# Altium schematic sheet IR_Sensor.SchDoc: IR_Sensor
size D; SheetNumber: 3; SheetTotal: 3; Project: IR_Sensor; ENG_APP_DATE: --/--/--; DSN_APP_DATE: --/--/--; CHK_APP_DATE: --/--/--; Version: 1
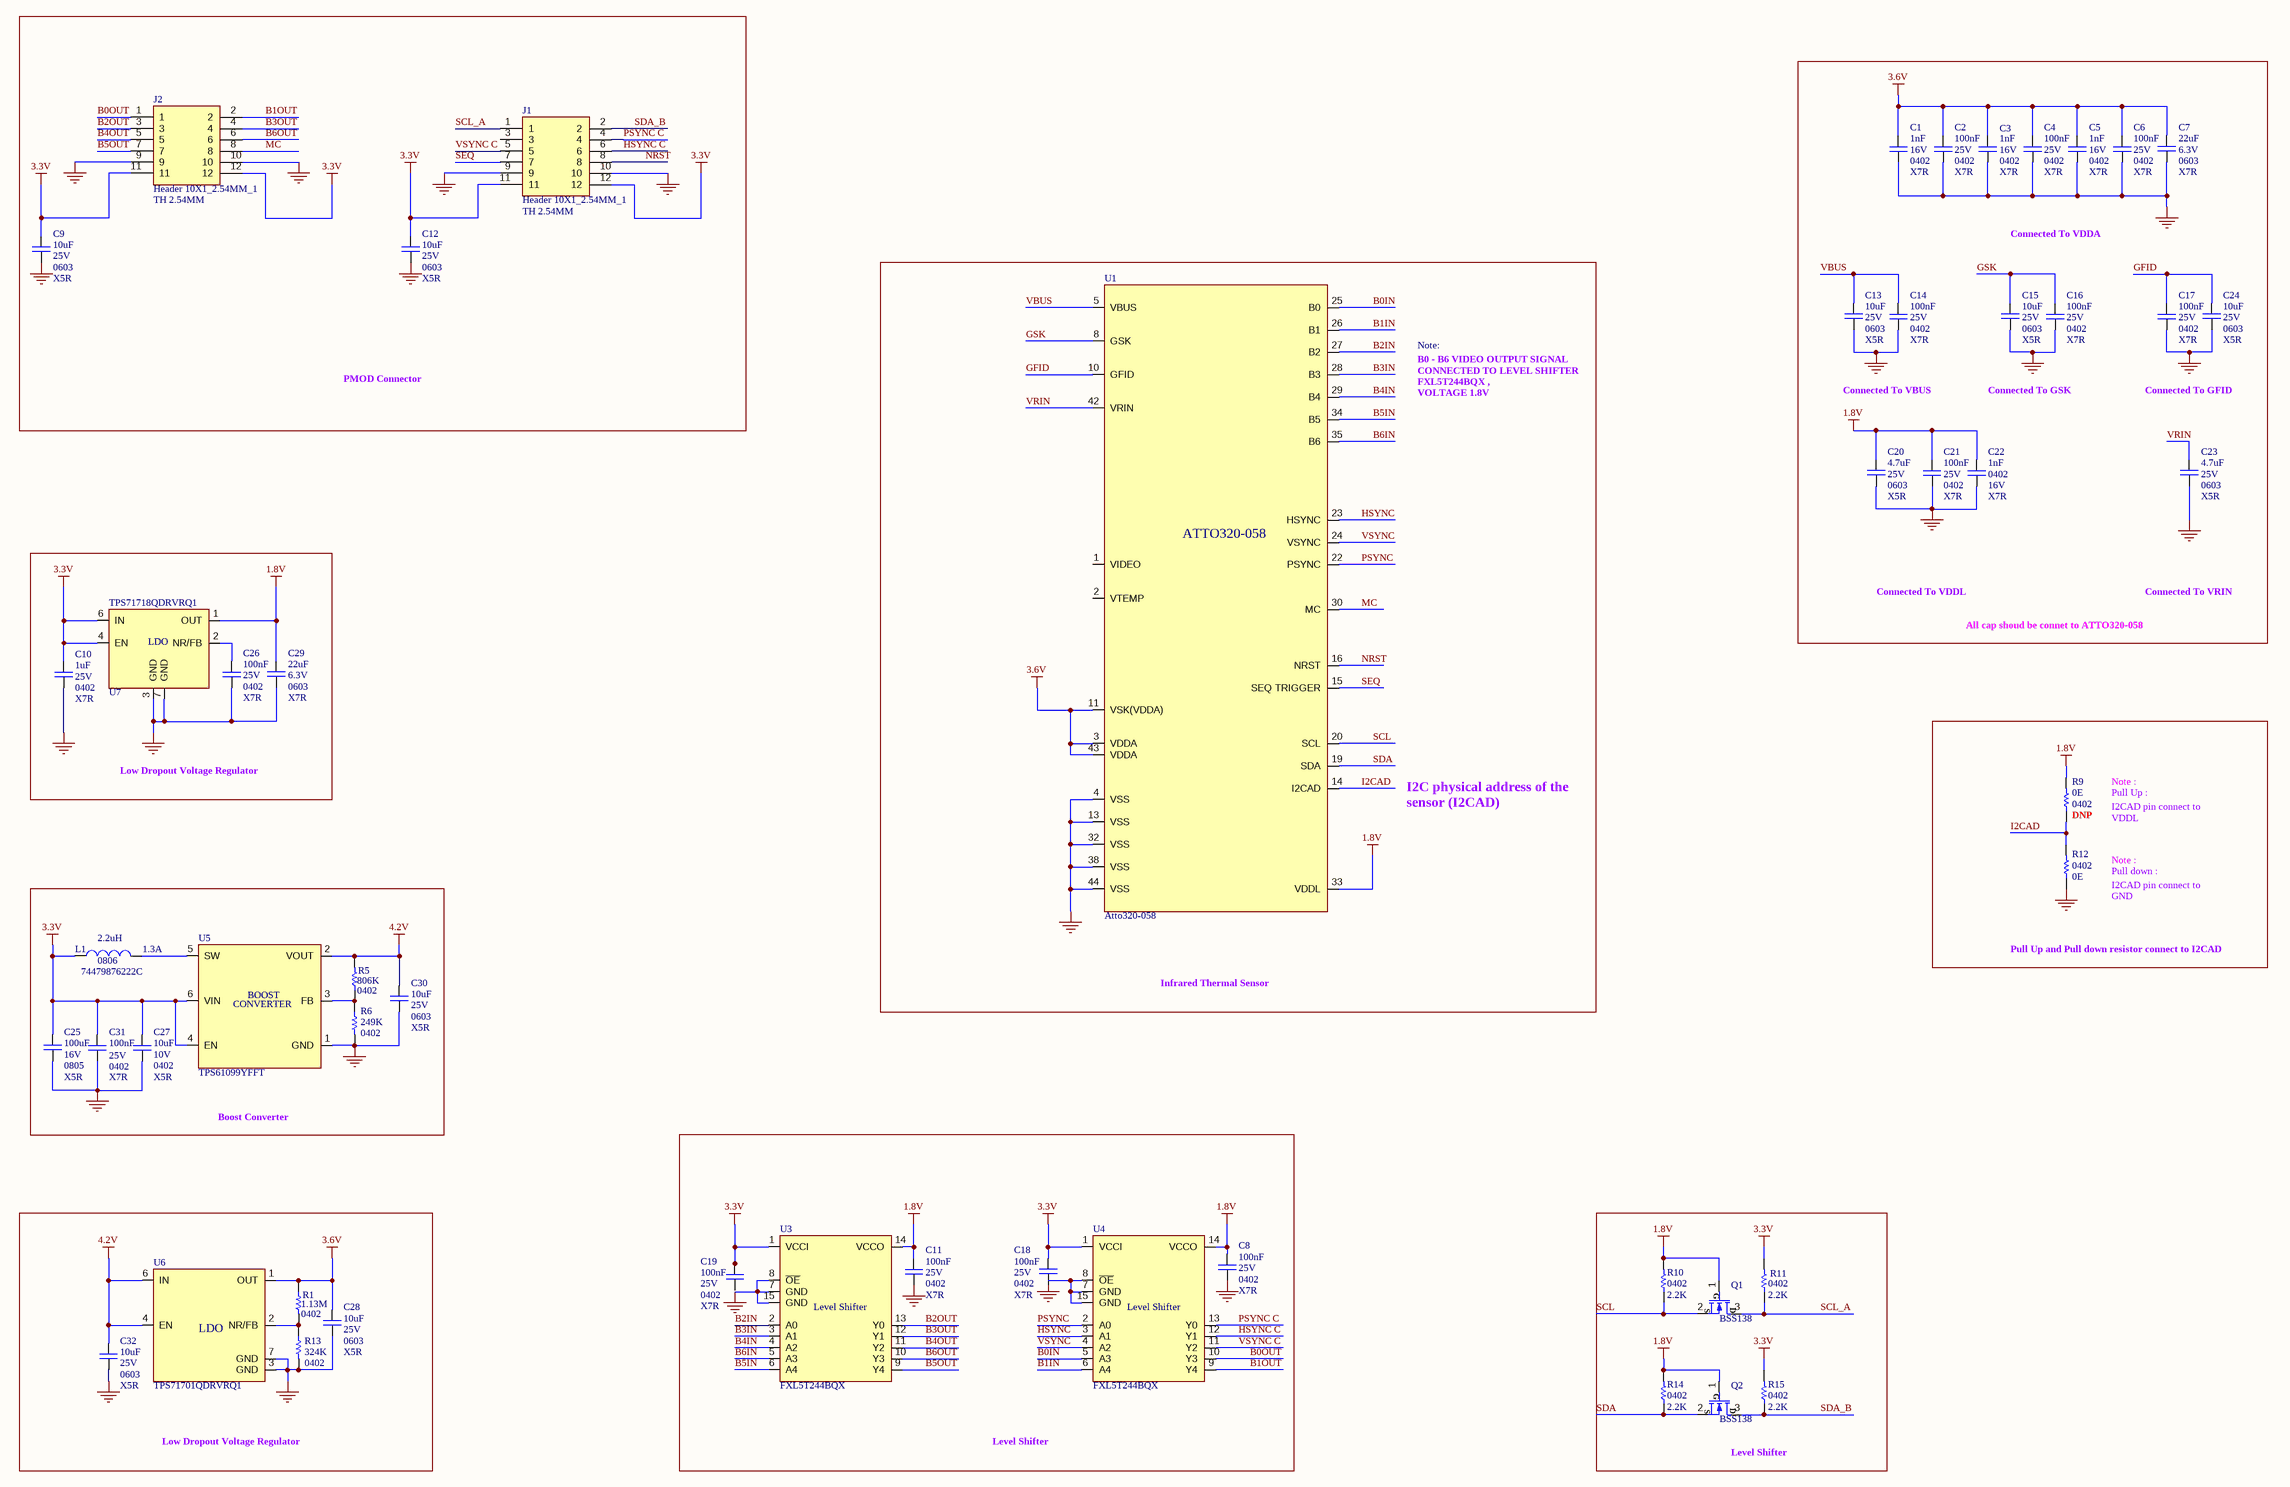
[diagram p0: IR_Sensor.SchDoc]

## Parts
C1  value 1nF  Voltage: 16V  Case/Package: 0402  dielectric: X7R  [CAPC0402]  (hidden comment: Cap)
C2  value 100nF  Voltage: 25V  Case/Package: 0402  dielectric: X7R  [CAPC0402]  (hidden comment: Cap)
C3  value 1nF  Voltage: 16V  Case/Package: 0402  dielectric: X7R  [CAPC0402]  (hidden comment: Cap)
C4  value 100nF  Voltage: 25V  Case/Package: 0402  dielectric: X7R  [CAPC0402]  (hidden comment: Cap)
C5  value 1nF  Voltage: 16V  Case/Package: 0402  dielectric: X7R  [CAPC0402]  (hidden comment: Cap)
C6  value 100nF  Voltage: 25V  Case/Package: 0402  dielectric: X7R  [CAPC0402]  (hidden comment: Cap)
C7  value 22uF  voltage: 6.3V  Case/Package: 0603  Dielectric: X7R  [CAPC0603]  (hidden comment: Cap)
C8  value 100nF  Voltage: 25V  Case/Package: 0402  dielectric: X7R  [CAPC0402]  (hidden comment: Cap)
C9  value 10uF  voltage: 25V  Case/Package: 0603  Dielectric: X5R  [CAPC0603]  (hidden comment: Cap)
C10  value 1uF  Voltage: 25V  Case/Package: 0402  dielectric: X7R  [CAPC0402]  (hidden comment: Cap)
C11  value 100nF  Voltage: 25V  Case/Package: 0402  dielectric: X7R  [CAPC0402]  (hidden comment: Cap)
C12  value 10uF  voltage: 25V  Case/Package: 0603  Dielectric: X5R  [CAPC0603]  (hidden comment: Cap)
C13  value 10uF  voltage: 25V  Case/Package: 0603  Dielectric: X5R  [CAPC0603]  (hidden comment: Cap)
C14  value 100nF  Voltage: 25V  Case/Package: 0402  dielectric: X7R  [CAPC0402]  (hidden comment: Cap)
C15  value 10uF  voltage: 25V  Case/Package: 0603  Dielectric: X5R  [CAPC0603]  (hidden comment: Cap)
C16  value 100nF  Voltage: 25V  Case/Package: 0402  dielectric: X7R  [CAPC0402]  (hidden comment: Cap)
C17  value 100nF  Voltage: 25V  Case/Package: 0402  dielectric: X7R  [CAPC0402]  (hidden comment: Cap)
C18  value 100nF  Voltage: 25V  Case/Package: 0402  dielectric: X7R  [CAPC0402]  (hidden comment: Cap)
C19  value 100nF  Voltage: 25V  Case/Package: 0402  dielectric: X7R  [CAPC0402]  (hidden comment: Cap)
C20  value 4.7uF  Case/package: 0603  Dielectric: X5R  voltage: 25V  [CAPC0603]  (hidden comment: Cap)
C21  value 100nF  Voltage: 25V  Case/Package: 0402  dielectric: X7R  [CAPC0402]  (hidden comment: Cap)
C22  value 1nF  Voltage: 16V  Case/Package: 0402  dielectric: X7R  [CAPC0402]  (hidden comment: Cap)
C23  value 4.7uF  Voltage: 25V  Case/package: 0603  Dielectric: X5R  [CAPC0603]  (hidden comment: Cap)
C24  value 10uF  voltage: 25V  Case/Package: 0603  Dielectric: X5R  [CAPC0603]  (hidden comment: Cap)
C25  value 100uF  Case/Package: 0805  Dielectric: X5R  voltage: 16V  [CAPC0805]  (hidden comment: Cap)
C26  value 100nF  Voltage: 25V  Case/Package: 0402  dielectric: X7R  [CAPC0402]  (hidden comment: Cap)
C27  value 10uF  Voltage: 10V  Case/Package: 0402  dielectric: X5R  [CAPC0402]  (hidden comment: Cap)
C28  value 10uF  voltage: 25V  Case/Package: 0603  Dielectric: X5R  [CAPC0603]  (hidden comment: Cap)
C29  value 22uF  voltage: 6.3V  Case/Package: 0603  Dielectric: X7R  [CAPC0603]  (hidden comment: Cap)
C30  value 10uF  voltage: 25V  Case/Package: 0603  Dielectric: X5R  [CAPC0603]  (hidden comment: Cap)
C31  value 100nF  Voltage: 25V  Case/Package: 0402  dielectric: X7R  [CAPC0402]  (hidden comment: Cap)
C32  value 10uF  voltage: 25V  Case/Package: 0603  Dielectric: X5R  [CAPC0603]  (hidden comment: Cap)
J1  Header 10X1_2.54MM_1  Manufacturer Part Number: TH 2.54MM  [SAMTEC_HTSW-106-08-L-D-RA]
J2  Header 10X1_2.54MM_1  Manufacturer Part Number: TH 2.54MM  [SAMTEC_HTSW-106-08-L-D-RA]
L1  value 2.2uH  current: 1.3A  Case/Package: 0806  Manufacturer Part Number: 74479876222C  [IND_0402]  (hidden comment: Inductor)
Q1  MOSFET-N Si2302CDS  [BSS138]  (value not drawn)
Q2  MOSFET-N Si2302CDS  [BSS138]  (value not drawn)
R1  value 1.13M  Case/Package: 0402  [RESC0402]  (hidden comment: Resistor)
R5  value 806K  Case/Package: 0402  [RESC0402]  (hidden comment: Resistor)
R6  value 249K  Case/Package: 0402  [RESC0402]  (hidden comment: Resistor)
R9  value 0E  Case/Package: 0402  [RESC0402]  (hidden comment: Resistor)
R10  value 2.2K  Case/Package: 0402  [RESC0402]  (hidden comment: Resistor)
R11  value 2.2K  Case/Package: 0402  [RESC0402]  (hidden comment: Resistor)
R12  value 0E  Case/Package: 0402  [RESC0402]  (hidden comment: Resistor)
R13  value 324K  Case/Package: 0402  [RESC0402]  (hidden comment: Resistor)
R14  value 2.2K  Case/Package: 0402  [RESC0402]  (hidden comment: Resistor)
R15  value 2.2K  Case/Package: 0402  [RESC0402]  (hidden comment: Resistor)
U1  Atto320-058  [CQFP130P1823X1823X336-44N]
U3  FXL5T244BQX  [FXL5T244BQX]
U4  FXL5T244BQX  [FXL5T244BQX]
U5  TPS61099YFFT  [BGA TPS61099YFFT]
U6  TPS71701QDRVRQ1  [SON65P200X200X80-7N]
U7  TPS71718QDRVRQ1  [SON65P200X200X80-7N]

## Blocks framed on the sheet
PMOD Connector: C9 C12 J1 J2
Low Dropout Voltage Regulator: C10 C26 C29 U7
Boost Converter: C25 C27 C30 C31 L1 R5 R6 U5
Level Shifter: C8 C11 C18 C19 U3 U4
Low Dropout Voltage Regulator: C28 C32 R1 R13 U6
Level Shifter: Q1 Q2 R10 R11 R14 R15

## Nets
1.8V: C8.1 C11.1 C20.2 C21.1 C22.1 C29.2 Q1.1(G) Q2.1(G) R9.2 R10.2 R14.2 U1.33(VDDL) U3.14(VCCO) U4.14(VCCO) U7.1(OUT)
3.3V: C9.2 C10.1 C12.2 C18.2 C19.2 C25.2 C27.1 C31.1 J1.11 J1.12 J2.11 J2.12 L1.1 R11.2 R15.2 U3.1(VCCI) U4.1(VCCI) U5.4(EN) U5.6(VIN) U7.4(EN) U7.6(IN)
3.6V: C1.1 C2.1 C3.1 C4.1 C5.1 C6.1 C7.2 C28.2 R1.1 U1.3(VDDA) U1.11(VSK(VDDA)) U1.43(VDDA) U6.1(OUT)
4.2V: C30.2 C32.2 R5.2 U5.2(VOUT) U6.4(EN) U6.6(IN)
GND: C1.2 C2.2 C3.2 C4.2 C5.2 C6.2 C7.1 C8.2 C9.1 C10.2 C11.2 C12.1 C13.1 C14.2 C15.1 C16.2 C17.2 C20.1 C21.2 C22.2 C23.1 C24.1 C25.1 C26.2 C27.2 C28.1 C29.1 C30.1 C31.2 C32.1 J1.9 J1.10 J2.9 J2.10 R6.2 R12.1 R13.2 U1.4(VSS) U1.13(VSS) U1.32(VSS) U1.38(VSS) U1.44(VSS) U3.7(GND) U3.8(~{OE}) U3.15(GND) U4.7(GND) U4.8(~{OE}) U4.15(GND) U5.1(GND) U6.3(GND) U6.7(GND) U7.3(GND) U7.7(GND)
B0IN: U1.25(B0) U4.5(A3)
B0OUT: J2.1 U4.10(Y3)
B1IN: U1.26(B1) U4.6(A4)
B1OUT: J2.2 U4.9(Y4)
B2IN: U1.27(B2) U3.2(A0)
B2OUT: J2.3 U3.13(Y0)
B3IN: U1.28(B3) U3.3(A1)
B3OUT: J2.4 U3.12(Y1)
B4IN: U1.29(B4) U3.4(A2)
B4OUT: J2.5 U3.11(Y2)
B5IN: U1.34(B5) U3.6(A4)
B5OUT: J2.7 U3.9(Y4)
B6IN: U1.35(B6) U3.5(A3)
B6OUT: J2.6 U3.10(Y3)
GFID: C17.1 C24.2 U1.10(GFID)
GSK: C15.2 C16.1 U1.8(GSK)
HSYNC: U1.23(HSYNC) U4.3(A1)
HSYNC C: J1.6 U4.12(Y1)
I2CAD: R9.1 R12.2 U1.14(I2CAD)
MC: J2.8 U1.30(MC)
NRST: J1.8 U1.16(NRST)
PSYNC: U1.22(PSYNC) U4.2(A0)
PSYNC C: J1.4 U4.13(Y0)
SCL: Q1.2(S) R10.1 U1.20(SCL)
SCL_A: J1.1 Q1.3(D) R11.1
SDA: Q2.2(S) R14.1 U1.19(SDA)
SDA_B: J1.2 Q2.3(D) R15.1
SEQ: J1.7 U1.15(SEQ_TRIGGER)
VBUS: C13.2 C14.1 U1.5(VBUS)
VRIN: C23.2 U1.42(VRIN)
VSYNC: U1.24(VSYNC) U4.4(A2)
VSYNC C: J1.5 U4.11(Y2)
NetC26_1: C26.1 U7.2(NR/FB)
NetL1_2: L1.2 U5.5(SW)
NetR1_2: R1.2 R13.1 U6.2(NR/FB)
NetR5_1: R5.1 R6.1 U5.3(FB)

Not connected (* = marked no-connect by the designer): C18 1; C19 1; J1 3; U1 1(VIDEO) 2(VTEMP)

## Notes on the sheet
- Connected To VDDA
- Note:
- B0 - B6 VIDEO OUTPUT SIGNAL                                     CONNECTED TO LEVEL SHIFTER FXL5T244BQX ,                             VOLTAGE 1.8V
- Connected To VBUS
- Connected To GSK
- Connected To GFID
- Connected To VDDL
- All cap shoud be connet to ATTO320-058
- Connected To VRIN
- I2C physical address of the sensor (I2CAD)
- Pull Up :
- Note :
- (near R9) DNP
- I2CAD pin connect to VDDL
- Pull down :
- I2CAD pin connect to GND
- Pull Up and Pull down resistor connect to I2CAD
- Infrared Thermal Sensor
- TITLE :-
- VERSION :-
- PROJECT :-
- SHEET :-
- REVISION:-
- OF
- CONFIDENTIAL
- DATE :-
- (in symbol FXL5T244BQX) Level Shifter
- (in symbol TPS61099YFFT) BOOST; CONVERTER
- (in symbol TPS71701QDRVRQ1) LDO
- (in symbol TPS71718QDRVRQ1) LDO

## Library data of the parts
C1 C3 C5 C22 = Cap: CAP CER 1nF 16V X7R 0402
C2 C4 C6 C8 C11 C14 C16-C19 C21 C26 C31 = Cap: CAP CER 100nF 25V X7R 0402
C7 C29 = Cap: CAP CER 22uF 6.3V X7R 0603
C9 C12 C13 C15 C24 C28 C30 C32 = Cap: CAP CER 10uF 25V X5R 0603
C10 = Cap: CAP CER 1uF 25V X7R 0402
C20 C23 = Cap: CAP CER 4.7uF 25V X5R 0603
C25 = Cap: CAP CER 100uF 16V X5R 0805
C27 = Cap: CAP CER 10uF 0402 10V X5R
L1 = Inductor: 2.2uH 1.3A 210mOhms
Q1 Q2 = bss138_1: N-Channel 50 V 220mA (Ta) 350mW (Ta) Surface Mount SOT-23; Manufacturer Part Number: BSS138; Case/Package: TO-236-3, SC-59, SOT-23-3
R1 = Resistor: Thick Film Resistor -  1.13M, 1%, 0402
R5 = Resistor: Thick Film Resistor -  806K, 1%, 0402
R6 = Resistor: Thick Film Resistor -  249K, 1%, 0402
R9 R12 = Resistor: Thick Film Resistor -  0E, 1%, 0402
R10 R11 R14 R15 = Resistor: Thick Film Resistor -  2.2k, 1%, 0402
R13 = Resistor: Thick Film Resistor -  324K, 1%, 0402
U1 = Atto320-058: tharmal image sensor Atto320-058; Manufacturer Part Number: ATTO320-058; Case/Package: J-LEAD 44
U3 U4 = FXL5T244BQX: Voltage Level Translator Unidirectional 1 Circuit 5 Channel 14-DQFN (3x2.5); Case/Package: 14-VFQFN Exposed Pad; Manufacturer Part Number: FXL5T244BQX
U5 = TPS61099YFFT: Boost Switching Regulator IC Positive Adjustable 1.8V 1 Output 800mA (Switch) 6-UFBGA, DSBGA; Manufacturer Part Number: TPS61099YFFT; Case/Package: 6-UFBGA, DSBGA
U6 = TPS71701QDRVRQ1: Linear Voltage Regulator IC Positive Adjustable 1 Output 150mA 6-WSON (2x2); Case/Package: 6-WSON (2x2); Manufacturer Part Number: TPS71701QDRVRQ1
U7 = TPS71718QDRVRQ1: Linear Voltage Regulator IC Positive Fixed 1 Output 150mA 6-WSON (2x2); Case/Package: 6-WDFN Exposed Pad; Manufacturer Part Number: TPS71718QDRVRQ1
J1 J2 = Header 10X1_2.54MM_1: Case/Package: TH